# EAGLE design SuperSensors_DIP (EAGLE 7.1.0)
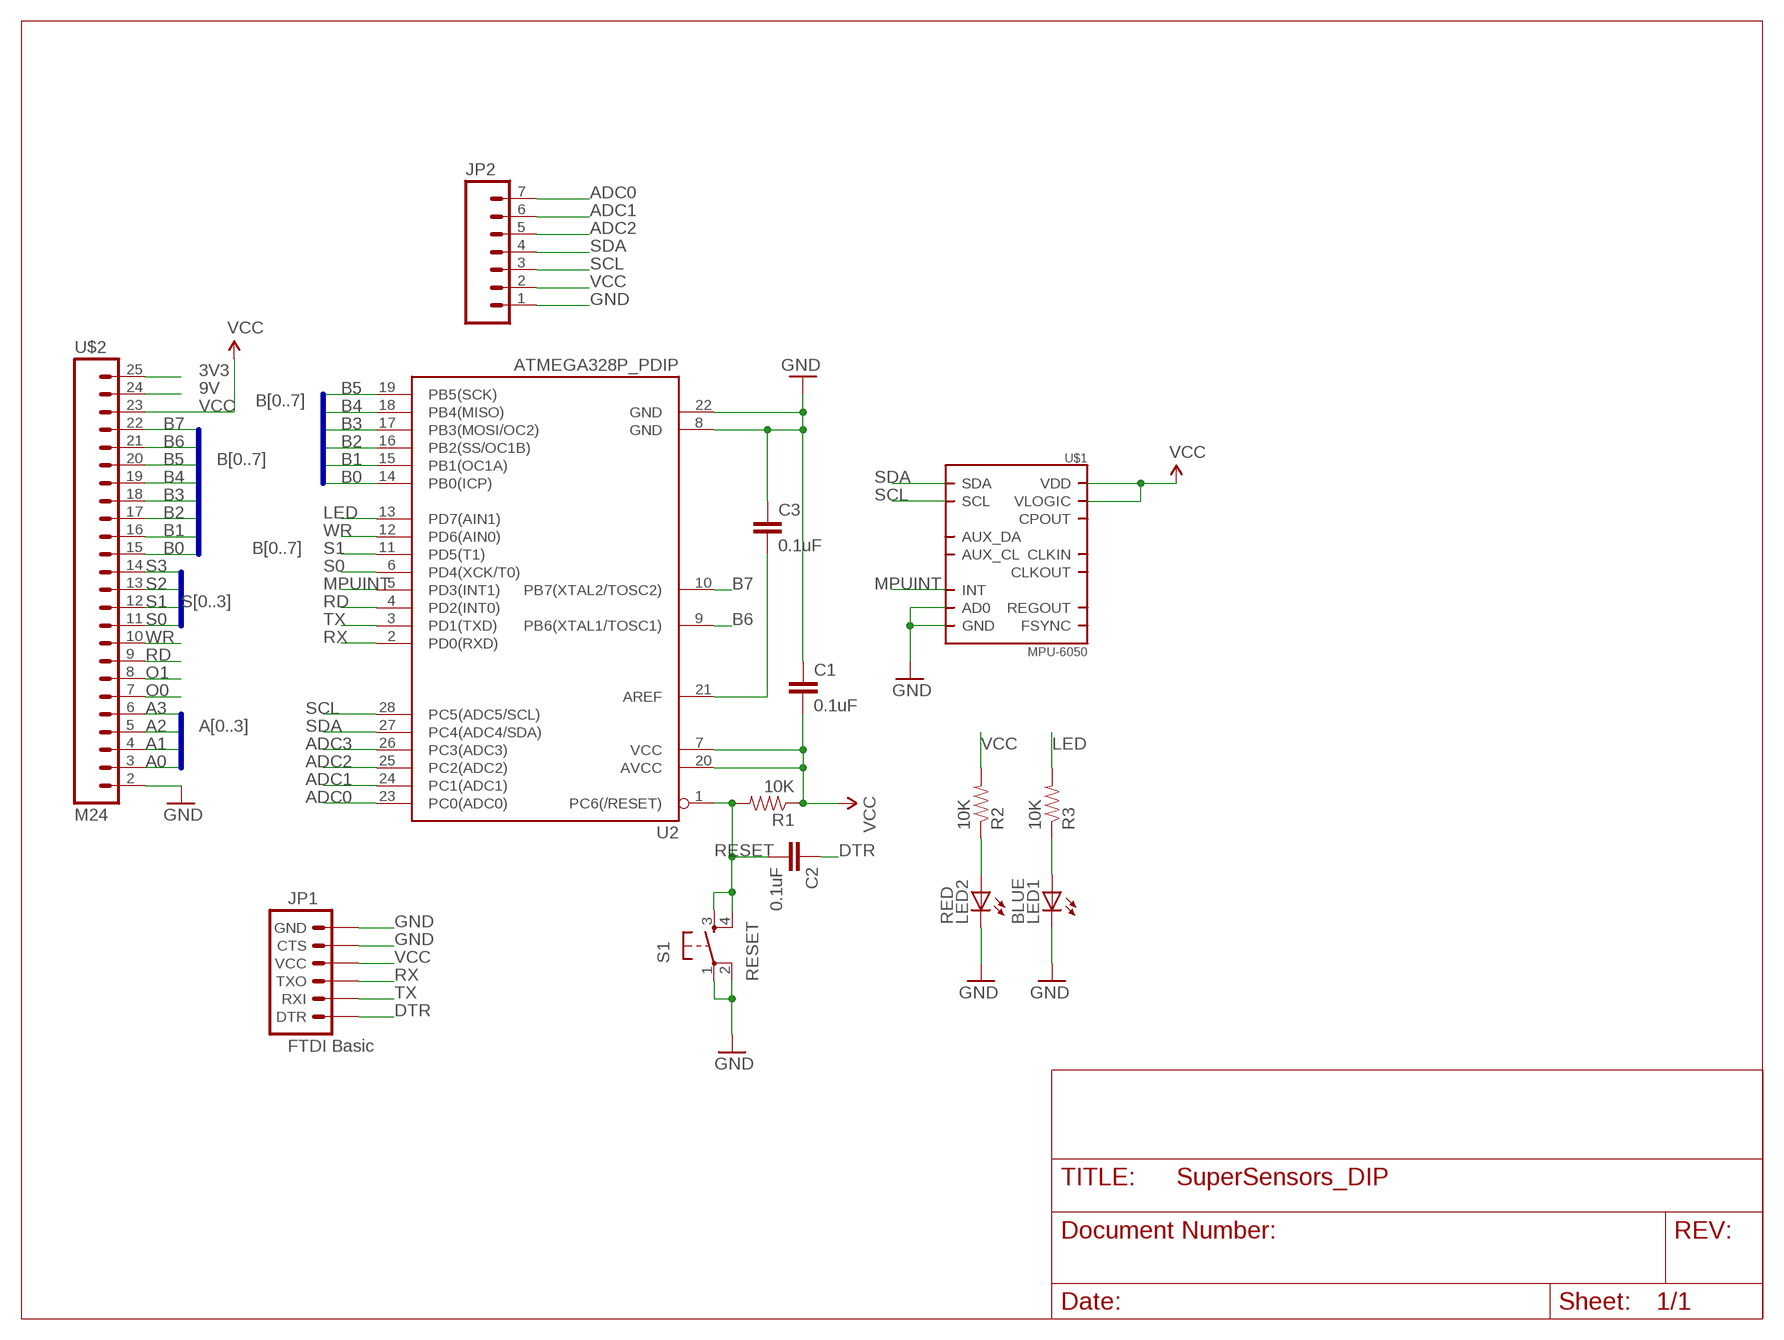
[diagram p0: schematic, sheet 1]

## Parts
C1  0.1uF  CAPPTH  [CAP-PTH-SMALL]
C2  0.1uF  CAPPTH  [CAP-PTH-SMALL]
C3  0.1uF  CAPPTH  [CAP-PTH-SMALL]
JP1  FTDI Basic  ARDUINO_SERIAL_PROGRAMPTH  [1X06]
JP2  M07  [1X07]
LED1  BLUE  LED5MM  [LED5MM]
LED2  RED  LED5MM  [LED5MM]
R1  10K  RESISTORPTH-1/4W  [AXIAL-0.4]
R2  10K  RESISTORPTH-1/4W  [AXIAL-0.4]
R3  10K  RESISTORPTH-1/4W  [AXIAL-0.4]
S1  RESET  TAC_SWITCHSMD  [TACTILE_SWITCH_SMD]
U2  ATMEGA328P_PDIP  [DIL28-3]
U$1  MPU-6050  [QFN.24.4X4]
U$2  M24  [1X24]

## Nets
3V3: U$2.25
9V: U$2.24
A0: U$2.3
A1: U$2.4
A2: U$2.5
A3: U$2.6
ADC0: JP2.7 U2.23(PC0(ADC0))
ADC1: JP2.6 U2.24(PC1(ADC1))
ADC2: JP2.5 U2.25(PC2(ADC2))
ADC3: U2.26(PC3(ADC3))
B0: U2.14(PB0(ICP)) U$2.15
B1: U2.15(PB1(OC1A)) U$2.16
B2: U2.16(PB2(SS/OC1B)) U$2.17
B3: U2.17(PB3(MOSI/OC2)) U$2.18
B4: U2.18(PB4(MISO)) U$2.19
B5: U2.19(PB5(SCK)) U$2.20
B6: U2.9(PB6(XTAL1/TOSC1)) U$2.21
B7: U2.10(PB7(XTAL2/TOSC2)) U$2.22
DTR: C2.1 JP1.1(DTR)
GND: C1.1 C3.1 JP1.5(CTS) JP1.6(GND) JP2.1 LED1.K(C) LED2.K(C) S1.1 S1.2 U2.8(GND) U2.22(GND) U$1.9(AD0) U$1.18(GND) U$2.2
LED: R3.P$2 U2.13(PD7(AIN1))
MPUINT: U2.5(PD3(INT1)) U$1.12(INT)
N$1: LED2.A R2.P$1
N$2: C3.2 U2.21(AREF)
N$3: LED1.A R3.P$1
O0: U$2.7
O1: U$2.8
RD: U2.4(PD2(INT0)) U$2.9
RESET: C2.2 R1.P$2 S1.3 S1.4 U2.1(PC6(/RESET))
RX: JP1.3(TXO) U2.2(PD0(RXD))
S0: U2.6(PD4(XCK/T0)) U$2.11
S1: U2.11(PD5(T1)) U$2.12
S2: U$2.13
S3: U$2.14
SCL: JP2.3 U2.28(PC5(ADC5/SCL)) U$1.23(SCL)
SDA: JP2.4 U2.27(PC4(ADC4/SDA)) U$1.24(SDA)
TX: JP1.2(RXI) U2.3(PD1(TXD))
VCC: C1.2 JP1.4(VCC) JP2.2 R1.P$1 R2.P$2 U2.7(VCC) U2.20(AVCC) U$1.8(VLOGIC) U$1.13(VDD) U$2.23
WR: U2.12(PD6(AIN0)) U$2.10
Unconnected: U$1.1(CLKIN) U$1.6(AUX_DA) U$1.7(AUX_CL) U$1.10(REGOUT) U$1.11(FSYNC) U$1.20(CPOUT) U$1.22(CLKOUT)

## Buses
B[0..7]
S[0..3]
A[0..3]

## Library data of the parts
C1-C3 = SparkFun-Capacitors:CAP: Capacitor Standard 0603 ceramic capacitor, and 0.1" leaded capacitor.
JP1 = SparkFun-Connectors:ARDUINO_SERIAL_PROGRAM: FTDI connector footprints
JP2 = SparkFun-Connectors:M07: Header 7 Standard 7-pin 0.1" header. Use with straight break away headers (SKU : PRT-00116), right angle break away headers (PRT-00553), swiss pins (PRT-00743), machine pins (PRT-00117), and female headers (PRT-00115). NOTES ON THE VARIANTS LOCK and LOCK_LONGPADS... This footprint was designed to help hold the alignment of a through-hole component (i.e. 7-pin header) while soldering it into place. You may notice that each hole has been shifted either up or down by 0.005 of an inch from it's more standard position (which is usually a perfectly straight line). This slight alteration caused the pins (the squares in the middle) to touch the edges of the holes. Because they are alternating, it causes a "brace" to hold the header in place. 0.005 has proven to be the perfect amount of "off-center" position when using our standard breakaway headers. Although looks a little odd when you look at the bare footprint, once you have a header in there, the alteration is very hard to notice. Also, if you push a header all the way into place, it is covered up entirely on the bottom side. This idea of altering the position of holes to aid alignment will be further integrated into the Sparkfun Library for other footprints. It can help hold any component with 3 or more connection pins.
LED1 LED2 = SparkFun-LED:LED: LEDs Standard schematic elements and footprints for 5mm, 3mm, 1206, and 0603 sized LEDs. 5mm - Spark Fun Electronics SKU : COM-00529 (and others)
R1-R3 = SparkFun-Passives:RESISTOR: Resistor Basic schematic elements and footprints for 0603, 1206, and PTH resistors.
S1 = SparkFun-Electromechanical:TAC_SWITCH: Momentary Switch Button commonly used for reset or general input. Spark Fun Electronics SKU : COM-00097 SMT- SWCH-08247; PROD_ID: SWCH-08247
U2 = SparkFun-DigitalIC:ATMEGA328P_PDIP: uC used in the Arduino 32kb flash, 1k EEPROM, 2k SRAM This is the through-hole version of this chip.
U$1 = invensense:MPU-6050
U$2 = SparkFun-Connectors:M24: 1x24 .1" header

## Board
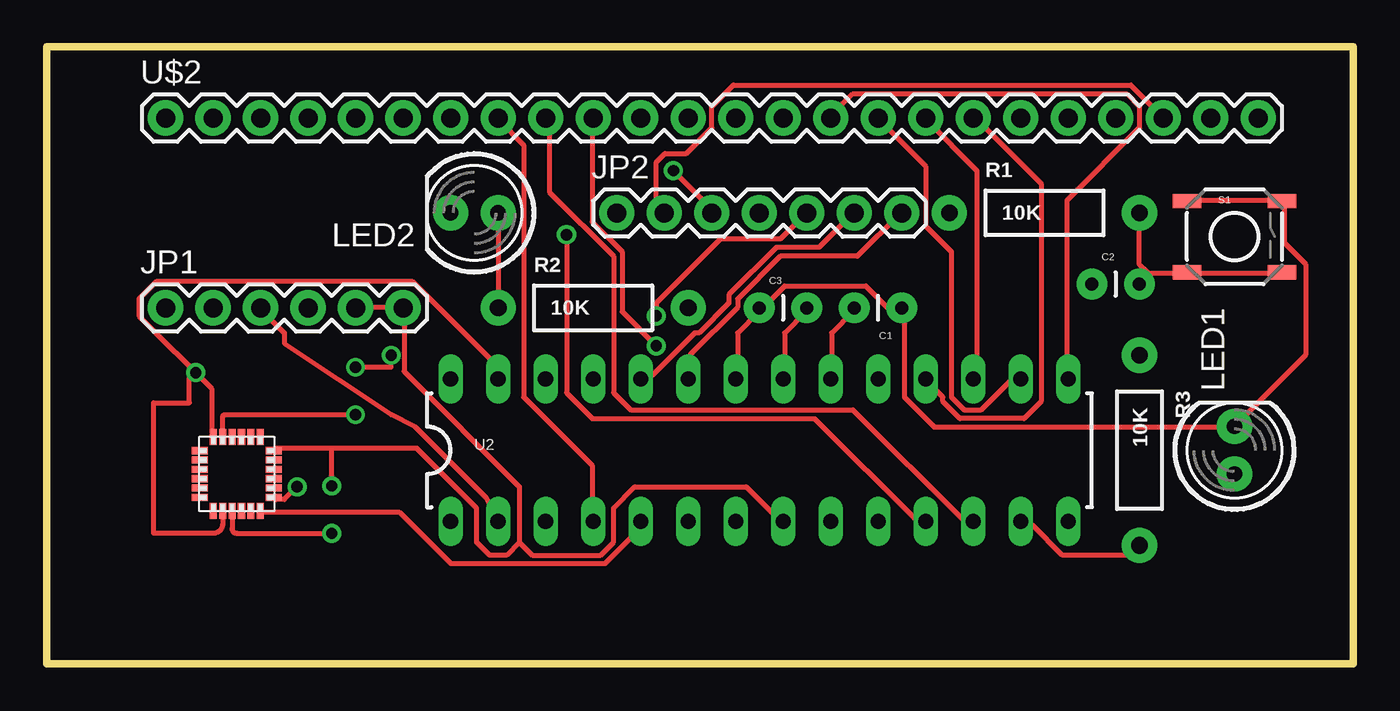
[diagram p1: board, top side]
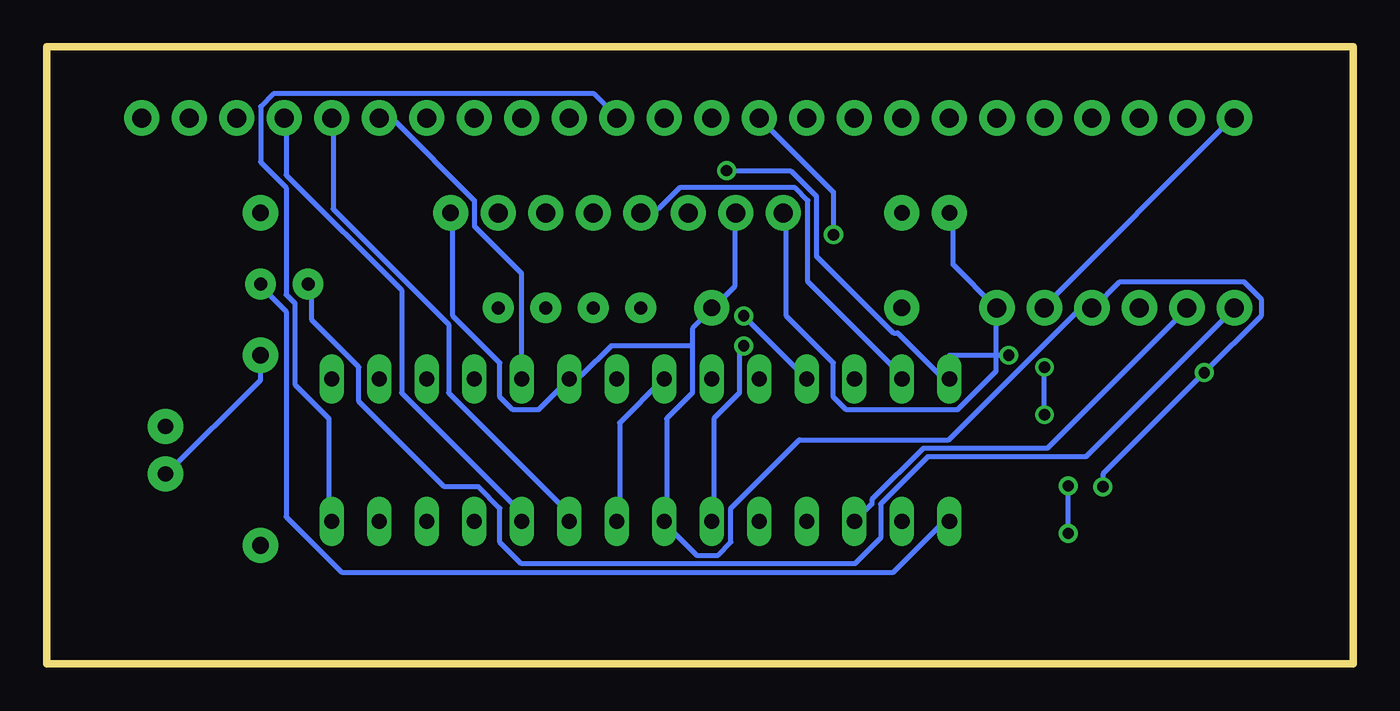
[diagram p2: board, bottom side, seen from below]

Size 69.85 x 33.02 mm. Coordinates in mm from the lower left corner, seen from the top.
Outline: 0,33.02 0,0 69.85,0 69.85,33.02 0,33.02
Copper layers (1*16): Top 0.035mm / dielectric 1.5mm / Bottom 0.035mm
Design rules "default": minimum track width 10mil, minimum drill 24mil, track to track 8mil, track to pad 8mil, pad to pad 8mil, via to via 8mil, smd to smd 8mil, copper to edge 40mil, drill to drill 8mil, minimum pad ring 10mil, minimum via ring 8mil, stop-mask expansion 4mil, vias tented up to drill 0mil, thermal gap 10mil

### Footprints (pad centres in the part's own frame; a part is rotated, then mirrored left to right if it is on the bottom)
CAP-PTH-SMALL = drill 0.7 pad 1.651: 1 0,0; 2 2.54,0
1X06 = drill 1.016 pad 1.88: 1 0,0; 2 2.54,0; 3 5.08,0; 4 7.62,0; 5 10.16,0; 6 12.7,0
1X07 = drill 1.016 pad 1.88: 1 0,0; 2 2.54,0; 3 5.08,0; 4 7.62,0; 5 10.16,0; 6 12.7,0; 7 15.24,0
LED5MM = drill 0.813 pad 1.88: A -1.27,0; K 1.27,0
AXIAL-0.4 = drill 0.9 pad 1.88: P$1 -5.08,0; P$2 5.08,0
TACTILE_SWITCH_SMD = smd 1.524 x 0.762: 1 -2.54,1.905; 2 2.54,1.905; 3 -2.54,-1.905; 4 2.54,-1.905
DIL28-3 = drill 0.813 long: 1 -16.51,-3.81; 2 -13.97,-3.81; 3 -11.43,-3.81; 4 -8.89,-3.81; 5 -6.35,-3.81; 6 -3.81,-3.81; 7 -1.27,-3.81; 8 1.27,-3.81; 9 3.81,-3.81; 10 6.35,-3.81; 11 8.89,-3.81; 12 11.43,-3.81; 13 13.97,-3.81; 14 16.51,-3.81; 15 16.51,3.81; 16 13.97,3.81; 17 11.43,3.81; 18 8.89,3.81; 19 6.35,3.81; 20 3.81,3.81; 21 1.27,3.81; 22 -1.27,3.81; 23 -3.81,3.81; 24 -6.35,3.81; 25 -8.89,3.81; 26 -11.43,3.81; 27 -13.97,3.81; 28 -16.51,3.81
QFN.24.4X4 = smd 0.85 x 0.38: 1 -1.975,1.25; 2 -1.975,0.75; 3 -1.975,0.25; 4 -1.975,-0.25; 5 -1.975,-0.75; 6 -1.975,-1.25; 13 1.975,-1.25; 14 1.975,-0.75; 15 1.975,-0.25; 16 1.975,0.25; 17 1.975,0.75; 18 1.975,1.25 | smd 0.38 x 0.85: 7 -1.25,-1.975; 8 -0.75,-1.975; 9 -0.25,-1.975; 10 0.25,-1.975; 11 0.75,-1.975; 12 1.25,-1.975; 19 1.25,1.975; 20 0.75,1.975; 21 0.25,1.975; 22 -0.25,1.975; 23 -0.75,1.975; 24 -1.25,1.975
1X24 = drill 1.016 pad 1.88: 2 -26.67,0; 3 -24.13,0; 4 -21.59,0; 5 -19.05,0; 6 -16.51,0; 7 -13.97,0; 8 -11.43,0; 9 -8.89,0; 10 -6.35,0; 11 -3.81,0; 12 -1.27,0; 13 1.27,0; 14 3.81,0; 15 6.35,0; 16 8.89,0; 17 11.43,0; 18 13.97,0; 19 16.51,0; 20 19.05,0; 21 21.59,0; 22 24.13,0; 23 26.67,0; 24 29.21,0; 25 31.75,0

### Placement (x,y rotation side)
C1  45.72,19.05 180 top
C2  55.88,20.32 0 top
C3  38.1,19.05 0 top
JP1  6.35,19.05 0 top
JP2  30.48,24.13 0 top
LED1  63.5,11.43 90 top
LED2  22.86,24.13 180 top
R1  53.34,24.13 0 top
R2  29.21,19.05 0 top
R3  58.42,11.43 270 top
S1  63.5,22.86 0 top
U2  38.1,11.43 0 top
U$1  10.16,10.16 0 top
U$2  33.02,29.21 0 top

### Tracks (layer width: path | path; a pad name or v marks a point on that pad's centre or on a via)
ADC0
  Top 0.254: U2.23 34.42,15.42 34.42,16.56 36.93,19.07 36.93,19.53 39.22,21.82 43.33,21.82 45.62,24.1 JP2.7
ADC1
  Top 0.254: U2.24 31.9,15.42 32.36,15.42 34.65,17.7 34.87,17.7 36.47,19.3 36.47,19.76 38.99,22.28 41.28,22.28 43.1,24.1 JP2.6
ADC2  (via drill 0.61)
  Top 0.254: v32.59,18.62 32.59,19.3 36.02,22.73 39.22,22.73 40.59,24.1 JP2.5
  Bottom 0.254: v32.59,18.62 U2.25
B0
  Bottom 0.254: U2.14 54.76,7.64 54.76,13.13 56.59,14.96 56.59,19.3 57.05,19.76 57.05,25.48 58.42,26.85 58.42,29.82 57.73,30.51 40.59,30.51 39.45,29.36 U$2.15
B1
  Top 0.254: U2.15 54.53,15.42 54.53,24.79 58.42,28.68 58.42,29.82 57.73,30.51 43.1,30.51 41.96,29.36 U$2.16
B2
  Top 0.254: U2.16 52.02,15.19 51.56,15.19 49.96,13.59 49.05,13.59 48.36,14.27 48.36,22.05 46.99,23.42 46.99,26.62 44.48,29.13 U$2.17
B3
  Top 0.254: U2.17 49.73,15.42 49.73,26.39 46.99,29.13 U$2.18
B4
  Top 0.254: U2.18 46.99,15.19 47.9,14.27 47.9,14.05 48.82,13.13 52.25,13.13 53.16,14.05 53.16,25.7 49.73,29.13 U$2.19
B5
  Bottom 0.254: U2.19 44.48,15.42 44.48,20.9 46.99,23.42 46.99,24.79 51.33,29.13 52.02,29.13 U$2.20
B6
  Bottom 0.254: U2.9 41.96,7.64 41.96,8.1 48.36,14.5 48.36,18.16 54.53,24.33 54.53,29.13 U$2.21
B7
  Bottom 0.254: U2.10 44.48,7.64 44.48,8.1 50.88,14.5 50.88,19.99 57.05,26.16 57.05,29.13 U$2.22
DTR
  Bottom 0.254: C2.1 55.68,20.22 55.68,18.39 53.16,15.88 53.16,14.05 48.59,9.47 46.76,9.47 45.62,8.33 45.62,6.5 44.48,5.36 26.64,5.36 25.27,6.73 25.27,8.56 22.76,11.07 14.3,11.07 6.53,18.85 JP1.1
GND  (via drill 0.6)
  Top 0.254: S1.1 61.16,24.79 65.96,24.79 S1.2 66.19,24.56 66.19,22.5 67.33,21.36 67.33,16.56 63.68,12.9 LED1.K 63.45,12.67 47.45,12.67 45.85,14.27 45.85,18.85 C1.1 45.62,19.07 44.93,19.07 43.79,20.22 39.45,20.22 38.3,19.07 C3.1 38.08,18.85 36.93,17.7 36.93,15.42 U2.22 | 15.24,11.53 19.79,11.53 22.99,8.33 22.99,6.5 23.67,5.82 24.59,5.82 25.27,6.5 | 15.24,11.53 12.24,11.53 U$1.18 | 25.27,6.5 25.27,9.47 19.1,15.65 19.1,18.85 JP1.6 18.87,19.07 16.59,19.07 JP1.5 | 25.27,6.5 25.96,5.82 29.62,5.82 30.3,6.5 30.3,8.33 31.45,9.47 37.39,9.47 39.22,7.64 U2.8 | U$1.9 9.91,7.23 arc90 10.16,6.98 v15.24,6.98 | v15.24,9.52 15.24,11.53
  Bottom 0.254: U2.8 39.22,7.64 39.22,12.9 36.93,15.19 U2.22 | LED2.K 21.39,24.1 21.39,21.36 19.1,19.07 JP1.6 19.1,18.85 19.1,15.65 21.16,13.59 27.1,13.59 27.79,14.27 27.79,16.1 30.3,18.62 30.3,24.1 JP2.1 | U$2.2 6.53,29.13 16.59,19.07 JP1.5 | v15.24,6.98 v15.24,9.52
LED
  Top 0.254: U2.13 52.25,7.42 52.71,7.42 54.3,5.82 57.96,5.82 58.42,6.27 R3.P$2
MPUINT
  Top 0.254: U$1.12 11.56,8.1 18.87,8.1 21.61,5.36 29.84,5.36 31.9,7.42 U2.5
N$1
  Top 0.254: LED2.A R2.P$1
N$2
  Top 0.254: U2.21 39.45,15.42 39.45,17.7 40.59,18.85 C3.2
N$3
  Bottom 0.254: R3.P$1 58.42,15.19 63.45,10.16 LED1.A
RD
  Top 0.254: U2.4 29.16,7.64 29.16,10.62 25.5,14.27 25.5,27.76 24.13,29.13 U$2.9
RESET
  Top 0.254: 58.88,20.9 60.94,20.9 S1.3 61.16,20.9 65.96,20.9 S1.4 | 58.88,20.9 58.42,20.45 C2.2 58.88,20.9 | R1.P$2 58.42,21.36 58.88,20.9
  Bottom 0.254: U2.1 21.61,7.42 22.07,7.42 24.59,4.9 54.08,4.9 57.05,7.87 57.05,18.85 58.42,20.22 C2.2
RX
  Top 0.254: JP1.3 11.56,18.85 12.7,17.7 12.7,17.15 18.41,13.34 19.68,12.7 23.5,8.89 U2.2
S0  (via drill 0.61)
  Top 0.254: v32.59,17.02 30.76,18.85 30.76,22.05 29.16,23.65 29.16,29.13 U$2.11
  Bottom 0.254: v32.59,17.02 32.82,16.79 32.82,14.5 34.19,13.13 34.19,7.64 U2.6
S1  (via drill 0.61)
  Top 0.254: v27.79,22.96 27.79,14.5 29.16,13.13 41.05,13.13 46.53,7.64 46.99,7.64 U2.11
  Bottom 0.254: v27.79,22.96 27.79,25.25 U$2.12
SCL  (via drill 0.6, 0.61)
  Top 0.254: v33.5,26.39 35.56,24.33 JP2.3 | U$1.23 9.41,13.22 arc-90 9.53,13.34 v16.51,13.34 | v16.51,15.88 18.41,15.88 v18.41,16.51
  Bottom 0.254: v33.5,26.39 30.07,26.39 28.7,25.02 28.7,21.82 24.59,17.7 24.36,17.7 22.07,15.42 21.61,15.42 U2.28 21.59,16.51 v18.41,16.51 | v16.51,13.34 v16.51,15.88
SDA
  Top 0.254: U2.27 24.13,15.88 19.56,20.45 5.84,20.45 4.93,19.53 4.93,18.62 8.81,14.73 8.81,12.22 U$1.24
  Bottom 0.254: JP2.4 38.08,24.33 37.16,24.33 36.02,25.48 29.84,25.48 29.16,24.79 29.16,20.45 24.13,15.42 U2.27
TX
  Bottom 0.254: U2.3 25.73,8.56 25.73,8.79 22.99,11.53 16.36,11.53 9.04,18.85 JP1.2
VCC  (via drill 0.6, 0.61)
  Top 0.254: v13.39,9.47 12.7,8.79 12.24,8.79 U$1.13 | U2.20 41.96,15.42 41.96,17.7 43.1,18.85 C1.2 | JP2.2 32.59,24.56 32.59,26.85 33.05,27.3 34.19,27.3 35.56,28.68 35.56,29.82 36.7,30.96 57.96,30.96 59.56,29.36 U$2.23 | U$1.8 9.41,7.5 arc-90 8.89,6.98 5.71,6.98 5.71,13.97 7.62,13.97 7.62,15.24 arc-90 v7.96,15.58
  Bottom 0.254: v13.39,9.47 13.39,10.16 8.28,15.27 | v7.96,15.58 4.93,18.62 4.93,19.53 5.84,20.45 12.47,20.45 13.84,19.07 JP1.4 14.07,18.85 14.76,18.85 21.61,11.99 29.62,11.99 33.27,8.33 33.27,6.5 33.96,5.82 35.1,5.82 36.7,7.42 U2.7 36.7,7.64 36.7,13.13 35.33,14.5 35.33,17.02 | v7.96,15.58 8.28,15.27 | R1.P$1 48.13,24.1 48.13,18.62 45.62,16.1 45.62,14.27 44.93,13.59 43.56,13.59 U2.20 41.73,15.42 41.28,15.42 39.68,17.02 35.33,17.02 | 35.33,17.02 35.33,17.93 34.42,18.85 R2.P$2 34.19,19.07 33.05,20.22 33.05,24.1 JP2.2 | v7.96,15.58 arc90 8.28,15.27
WR
  Top 0.254: U2.12 49.51,7.64 49.05,7.64 43.1,13.59 31.22,13.59 30.3,14.5 30.3,21.82 26.87,25.25 26.87,29.13 U$2.10